# Altium schematic sheet power.SchDoc
size A4; SheetNumber: 2; SheetTotal: 2
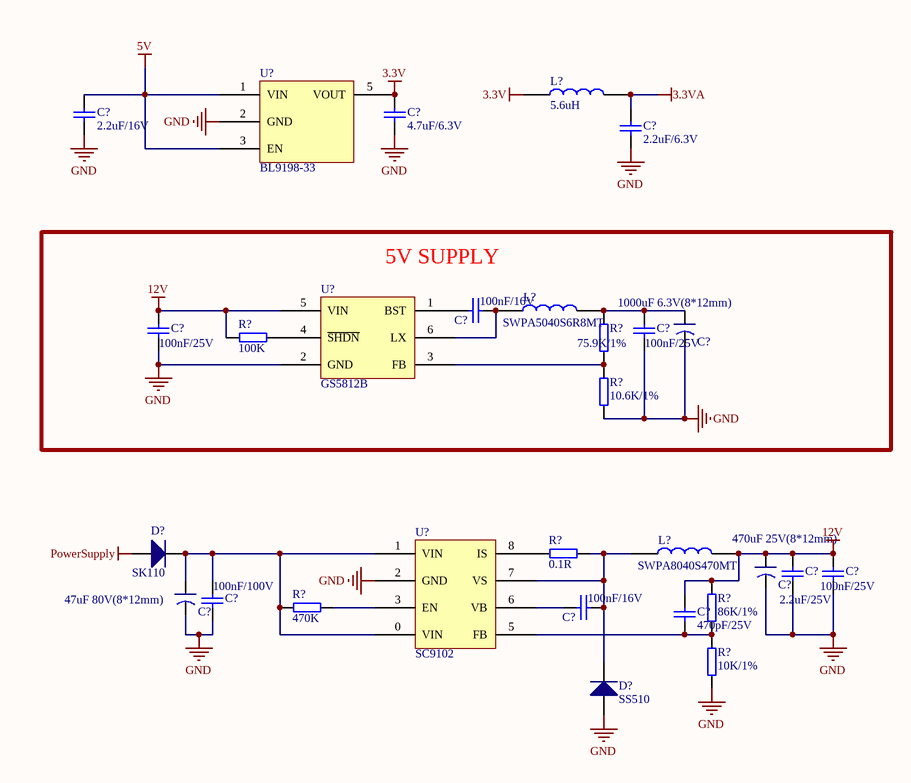
[diagram p0: power.SchDoc]

## Parts
(Parts that share a designator on the sheet are numbered #1, #2 ... from top to bottom, then left to right.)
C?#1  2.2uF/16V  [C0603]
C?#2  4.7uF/6.3V  [C0603]
C?#3  2.2uF/6.3V  [C0402]
C?#4  100nF/16V  [C0402]
C?#5  1000uF 6.3V(8*12mm)  [AL-ELEC 8*12mm]
C?#6  100nF/25V  [C0603]
C?#7  100nF/25V  [C0603]
C?#8  470uF 25V(8*12mm)  [AL-ELEC 8*12mm]
C?#9  2.2uF/25V  [C0603]
C?#10  100nF/25V  [C0603]
C?#11  47uF 80V(8*12mm)  [AL-ELEC 8*12mm]
C?#12  100nF/16V  [C0402]
C?#13  100nF/100V  [C1206]
C?#14  470pF/25V  [C0603]
D?#1  SK110  [DO-214AC SMA]
D?#2  SS510  [DO-214AC SMA]
L?#1  5.6uH  [L0402]
L?#2  SWPA5040S6R8MT  [SWPA5040S]
L?#3  SWPA8040S470MT  [SWPA8040S]
R?#1  100K  [R0603]
R?#2  75.9K/1%  [R0603]
R?#3  10.6K/1%  [R0603]
R?#4  0.1R  [R1206]
R?#5  470K  [R0603]
R?#6  86K/1%  [R0603]
R?#7  10K/1%  [R0603]
U?#1  BL9198-33  [SOT-23(5)]
U?#2  GS5812B  [SOT-23(6)]
U?#3  SC9102  [SOIC-8 EP]

## Blocks framed on the sheet
5V SUPPLY: C?#4-C?#7 L?#2 R?#1-R?#3 U?#2

## Nets
3.3V: C?#2.2 L?#1.1 U?#1.5(VOUT)
3.3VA: C?#3.2 L?#1.2
5V: C?#1.2 U?#1.1(VIN) U?#1.3(EN)
12V: C?#6.2 C?#8.1 C?#9.2 C?#10.2 C?#14.2 L?#3.2 R?#1.1 R?#6.2 U?#2.5(VIN)
GND: C?#1.1 C?#2.1 C?#3.1 C?#5.2 C?#6.1 C?#7.1 C?#8.2 C?#9.1 C?#10.1 C?#11.2 C?#13.1 D?#2.1 R?#3.1 R?#7.1 U?#1.2(GND) U?#2.2(GND) U?#3.2(GND)
PowerSupply: D?#1.1
NetC?#4_1: C?#4.1 L?#2.1 U?#2.6(LX)
NetC?#4_2: C?#4.2 U?#2.1(BST)
NetC?#5_1: C?#5.1 C?#7.2 L?#2.2 R?#2.2
NetC?#11_1: C?#11.1 C?#13.2 D?#1.2 R?#5.1 U?#3.0(VIN) U?#3.1(VIN)
NetC?#12_1: C?#12.1 D?#2.2 L?#3.1 R?#4.2 U?#3.7(VS)
NetC?#12_2: C?#12.2 U?#3.6(VB)
NetC?#14_1: C?#14.1 R?#6.1 R?#7.2 U?#3.5(FB)
NetR?#1_2: R?#1.2 U?#2.4(~{SHDN})
NetR?#2_1: R?#2.1 R?#3.2 U?#2.3(FB)
NetR?#4_1: R?#4.1 U?#3.8(IS)
NetR?#5_2: R?#5.2 U?#3.3(EN)

## Library data of the parts
C?#1-C?#3 C?#6 C?#7 C?#9 C?#10 C?#13 C?#14 = cap
C?#4 C?#12 = CAP: Capacitor
C?#5 C?#8 C?#11 = Capacitor: 铝电解电容
D?#1 D?#2 = Diode
L?#1 = INDUCTOR: 贴片电感
L?#2 L?#3 = INDUCTOR: 顺络 47uH
R?#1-R?#7 = Resistance
U?#1 = BL9161
U?#2 = GS5812B: 中广芯源